# EAGLE design Adafruit PiCowbell Adalogger (EAGLE 9.6.2)
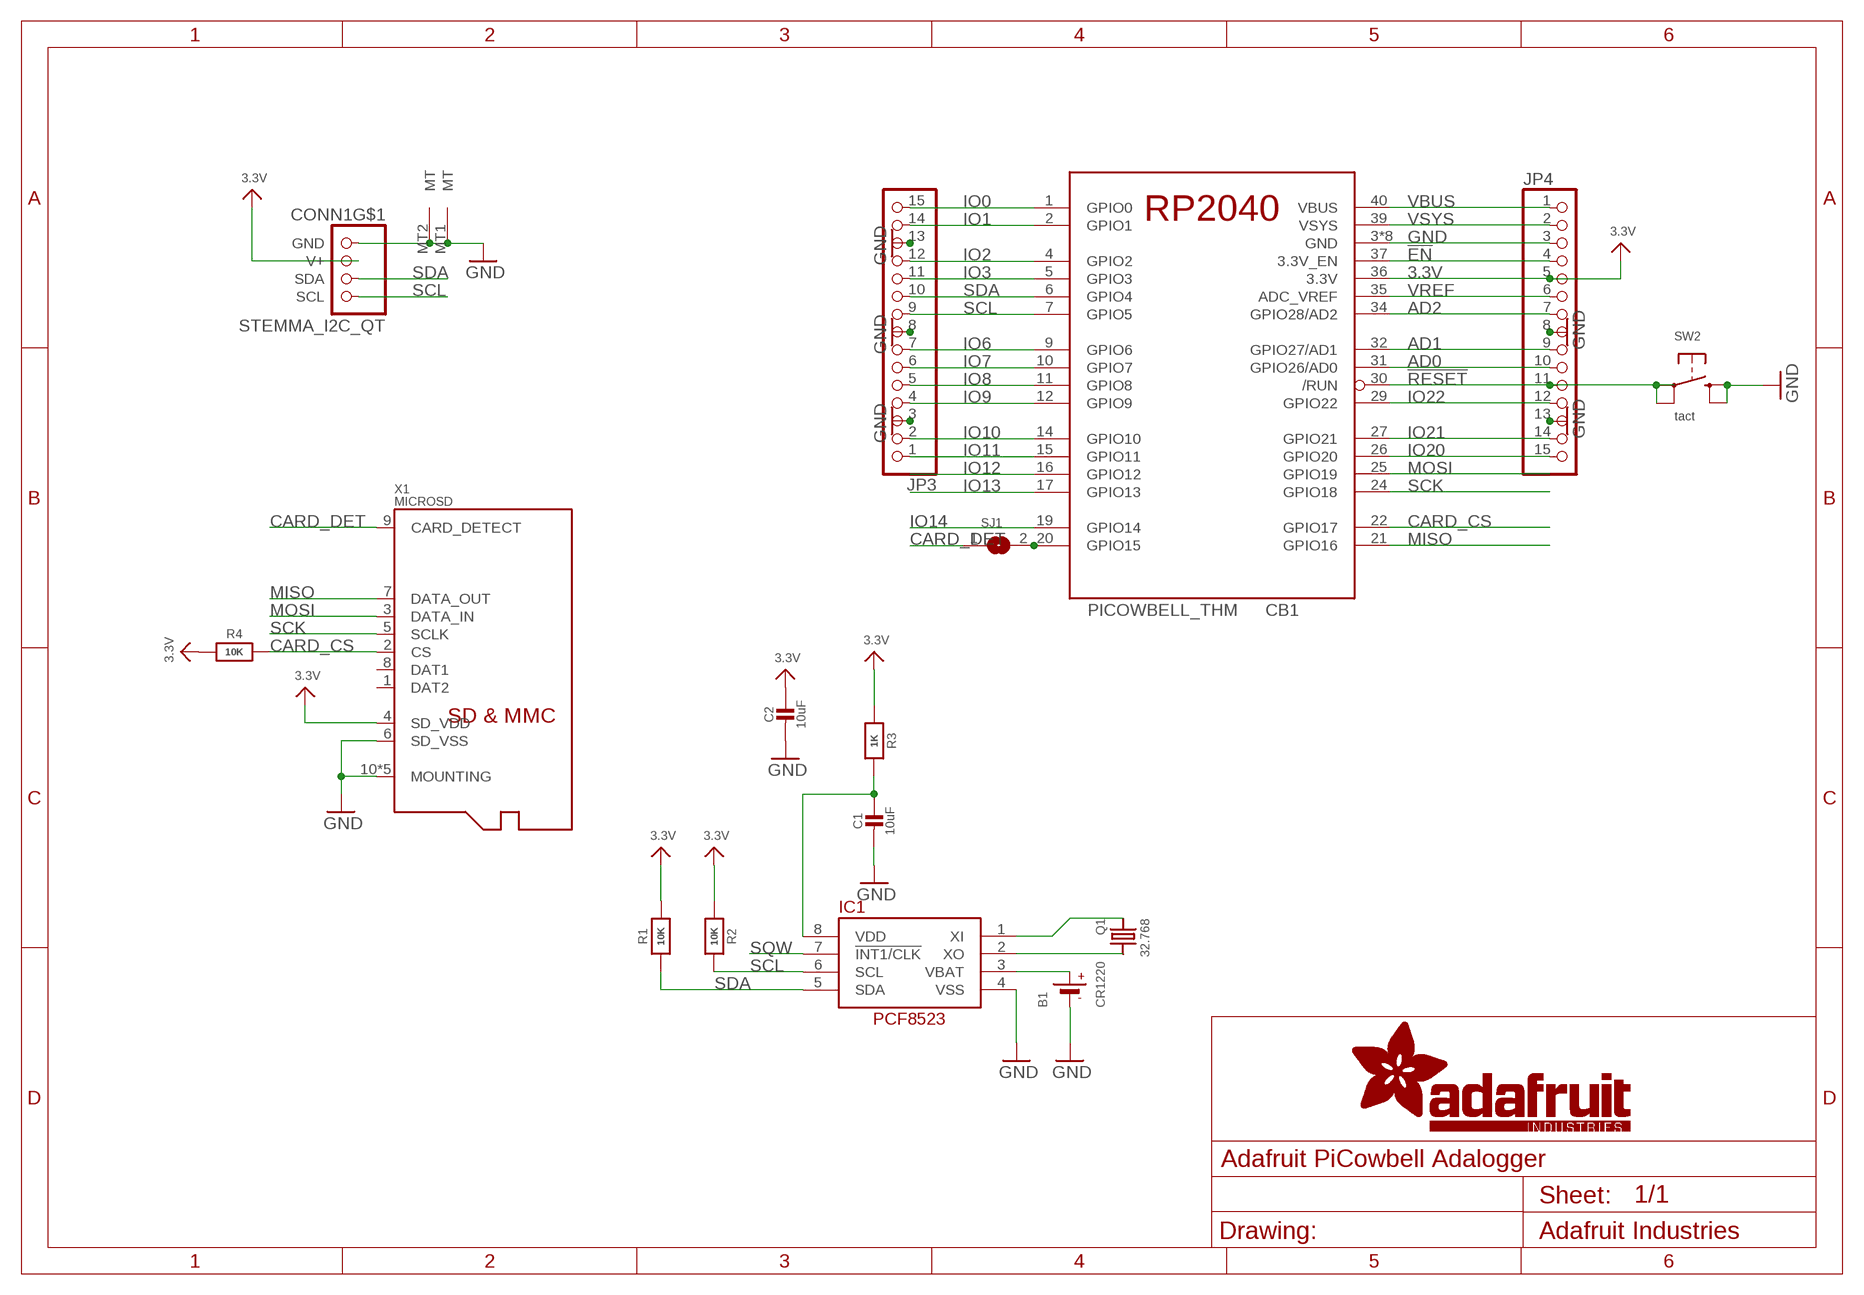
[diagram p0: schematic, sheet 1]

## Parts
B1  CR1220  BATTERYCR1220_2  [CR1220-2]
C1  10uF  CAP_CERAMIC0805-NOOUTLINE  [0805-NO]
C2  10uF  CAP_CERAMIC0805-NOOUTLINE  [0805-NO]
CB1  PICOWBELL_THM  [PICOWBELL_THM]
CONN1  STEMMA_I2C_QT  [JST_SH4]
IC1  RTC_PCF8523/T  [SOIC8_150MIL]
JP3  HEADER-1X15  [1X15_ROUND_70]
JP4  HEADER-1X15  [1X15_ROUND_70]
Q1  32.768  CRYSTAL_3215  [XTAL3215]
R1  10K  RESISTOR_0603_NOOUT  [0603-NO]
R2  10K  RESISTOR_0603_NOOUT  [0603-NO]
R3  1K  RESISTOR_0603_NOOUT  [0603-NO]
R4  10K  RESISTOR_0603_NOOUT  [0603-NO]
SJ1  SOLDERJUMPER  [SOLDERJUMPER_ARROW_NOPASTE]
SW2  tact  SWITCH_TACT_SMT_RKB2  [BTN_RKB2_4.6X2.8]
X1  MICROSD  MICROSD104031-0811  [MOLEX_104031-0811]

## Nets
3.3V: C2.1 CB1.36(3.3V) CONN1.2(V+) JP4.5 R1.2 R2.1 R3.1 R4.1 X1.4(SD_VDD)
!EN: CB1.37(3.3V_EN) JP4.4
!RESET: CB1.30(/RUN) JP4.11 SW2.A'(P1) SW2.A(P)
AD0: CB1.31(GPIO26/AD0) JP4.10
AD1: CB1.32(GPIO27/AD1) JP4.9
AD2: CB1.34(GPIO28/AD2) JP4.7
CARD_CS: CB1.22(GPIO17) R4.2 X1.2(CS)
CARD_DET: SJ1.1 X1.9(CARD_DETECT)
GND: B1.- C1.2 C2.2 CB1.3(GND) CB1.8(GND) CB1.13(GND) CB1.18(GND) CB1.23(GND) CB1.28(GND) CB1.33(GND) CB1.38(GND) CONN1.1(GND) CONN1.MT1(MT) CONN1.MT2(MT) IC1.4(VSS) JP3.3 JP3.8 JP3.13 JP4.3 JP4.8 JP4.13 SW2.B'(S1) SW2.B(S) X1.6(SD_VSS) X1.10(MOUNTING) X1.G1(MOUNTING) X1.G2(MOUNTING) X1.G3(MOUNTING) X1.G4(MOUNTING)
IO0: CB1.1(GPIO0) JP3.15
IO1: CB1.2(GPIO1) JP3.14
IO2: CB1.4(GPIO2) JP3.12
IO3: CB1.5(GPIO3) JP3.11
IO6: CB1.9(GPIO6) JP3.7
IO7: CB1.10(GPIO7) JP3.6
IO8: CB1.11(GPIO8) JP3.5
IO9: CB1.12(GPIO9) JP3.4
IO10: CB1.14(GPIO10) JP3.2
IO11: CB1.15(GPIO11) JP3.1
IO12: CB1.16(GPIO12)
IO13: CB1.17(GPIO13)
IO14: CB1.19(GPIO14)
IO20: CB1.26(GPIO20) JP4.15
IO21: CB1.27(GPIO21) JP4.14
IO22: CB1.29(GPIO22) JP4.12
MISO: CB1.21(GPIO16) X1.7(DATA_OUT)
MOSI: CB1.25(GPIO19) X1.3(DATA_IN)
N$1: CB1.20(GPIO15) SJ1.2
N$3: C1.1 IC1.8(VDD) R3.2
N$14: IC1.1(XI) Q1.P$1
N$15: IC1.2(XO) Q1.P$2
SCK: CB1.24(GPIO18) X1.5(SCLK)
SCL: CB1.7(GPIO5) CONN1.4(SCL) IC1.6(SCL) JP3.9 R2.2
SDA: CB1.6(GPIO4) CONN1.3(SDA) IC1.5(SDA) JP3.10 R1.1
SQW: IC1.7(!INT1/CLK)
VBAT: B1.+ IC1.3(VBAT)
VBUS: CB1.40(VBUS) JP4.1
VREF: CB1.35(ADC_VREF) JP4.6
VSYS: CB1.39(VSYS) JP4.2
Unconnected: X1.1(DAT2) X1.8(DAT1)

## Library data of the parts
B1 = adafruit_electromech:BATTERY: CR1220 SMT - Digikey: 3001K-ND CD2032 BAT-HLD-001 - Digikey: BAT-HLD-001-ND
C1 C2 = microbuilder:CAP_CERAMIC: Ceramic Capacitors For new designs, use the packages preceded by an '_' character since they are more reliable: The following footprints should be used on most boards: _0402 - Standard footprint for regular board layouts _0603 - Standard footprint for regular board layouts _0805 - Standard footprint for regular board layouts _1206 - Standard footprint for regular board layouts For extremely tight-pitch boards where space is at a premium, the following 'micro-pitch' footprints can be used (smaller pads, no silkscreen outline, etc.): _0402MP - Micro-pitch footprint for very dense/compact boards _0603MP - Micro-pitch footprint for very dense/compact boards _0805MP - Micro-pitch footprint for very dense/compact boards _1206MP - Micro-pitch footprint for very dense/compact boards
CB1 = adafruit_micro:PICOWBELL
CONN1 = adafruit_electromech:STEMMA_I2C; LCSC: C2845363
IC1 = microbuilder:RTC_PCF8523
JP3 JP4 = adafruit_electromech:HEADER-1X15: 1x15 Header
Q1 = microbuilder:CRYSTAL: Crystals HC49UP - Surface Mount Crystal 4.0MHz 18pF +/-30ppm Surface Mount Crystal [Digikey: 535-9857-1-ND] 12.0 MHz Surface Mount Crystal [Digikey: 535-9869-6-ND] 25.0 MHz Surface Mount Crystal [Digikey: 535-9078-1-ND] 2.5 x 2.0mm - MEMs SMT Crystal 16.0 MHz 10pF 20ppm 2.5 x 2.0mm Crystal [Digikey -40-85°C: 535-10923-1-ND] 3.2 x 2.5mm - MEMs SMT Crystal 12.0 MHz 8pF 15ppm 3.2 x 2.5mm Crystal [Digikey: -10-70°C: 644-1047-1-ND -40-125°C: 644-1128-1-ND] 40~85°C cheaper: 644-1173-6-ND 16.0 MHz 8pF 15ppm 3.2 x 2.5mm Crystal [Digikey: -10-70°C: 644-1049-1-ND -40-125°C: 644-1129-2-ND]-40~85°C cheaper: 644-1175-6-ND 16.0 MHz 10pF 10ppm 3.2 x 2.5mm Crystal [Digikey: 644-1100-1-ND] 27.12 MHz 18pF 30ppm 3.2 x 2.5mm Crystal [Digikey: 887-1424-1-ND] 27.12MHz 10pF 10ppm 3.2 x 2.5mm Crystal [Digikey: 887-1329-1-ND] 4.9 x 1.8mm - MEMs SMT Crystal 32.768 KHz 12.5pF 20ppm 4.9 x 1.8mm Crystal [Digikey: SE2415CT-ND] 8.0 x 3.8mm - Surface Mount Crystal 32.768kHz 12.5pF 20ppm -40°C-85°C [Digikey: 535-9166-2-ND] Cylinder 32.768KHz Cylinder Crystal (2x6mm body) [Ex. Digikey: 300-8341-2-ND]
R1-R4 = microbuilder:RESISTOR: Resistors For new designs, use the packages preceded by an '_' character since they are more reliable: The following footprints should be used on most boards: _0402 - Standard footprint for regular board layouts _0603 - Standard footprint for regular board layouts _0805 - Standard footprint for regular board layouts _1206 - Standard footprint for regular board layouts For extremely tight-pitch boards where space is at a premium, the following 'micro-pitch' footprints can be used (smaller pads, no silkscreen outline, etc.): _0402MP - Micro-pitch footprint for very dense/compact boards _0603MP - Micro-pitch footprint for very dense/compact boards _0805MP - Micro-pitch footprint for very dense/compact boards _1206MP - Micro-pitch footprint for very dense/compact boards
SJ1 = microbuilder:SOLDERJUMPER: SMD Solder JUMPER Solder the two pads together to create a connection, or remove the solder to break it. REFLOW - Use this footprint for solder paste and reflow ovens. WAVE - Use this footprint for hand-soldering (larger pads). CLOSED - Has a trace between the two pads to ensure it is closed by default. The trace needs to be cut to disable the jumper, and can be closed again by creating a solder bridge between the two pads.; BOM: EXCLUDE
SW2 = adafruit_electromech:SWITCH_TACT_SMT: SMT Tact Switches RKB2 https://www.digikey.com/short/m027prz5
X1 = adafruit_electromech:MICROSD: MicroSD/Transflash Card Holder with SPI pinout 3M: 2908-05WB-MG 4UConnector: 19656 Footprint courtesy: Adafruit Industries

## Board
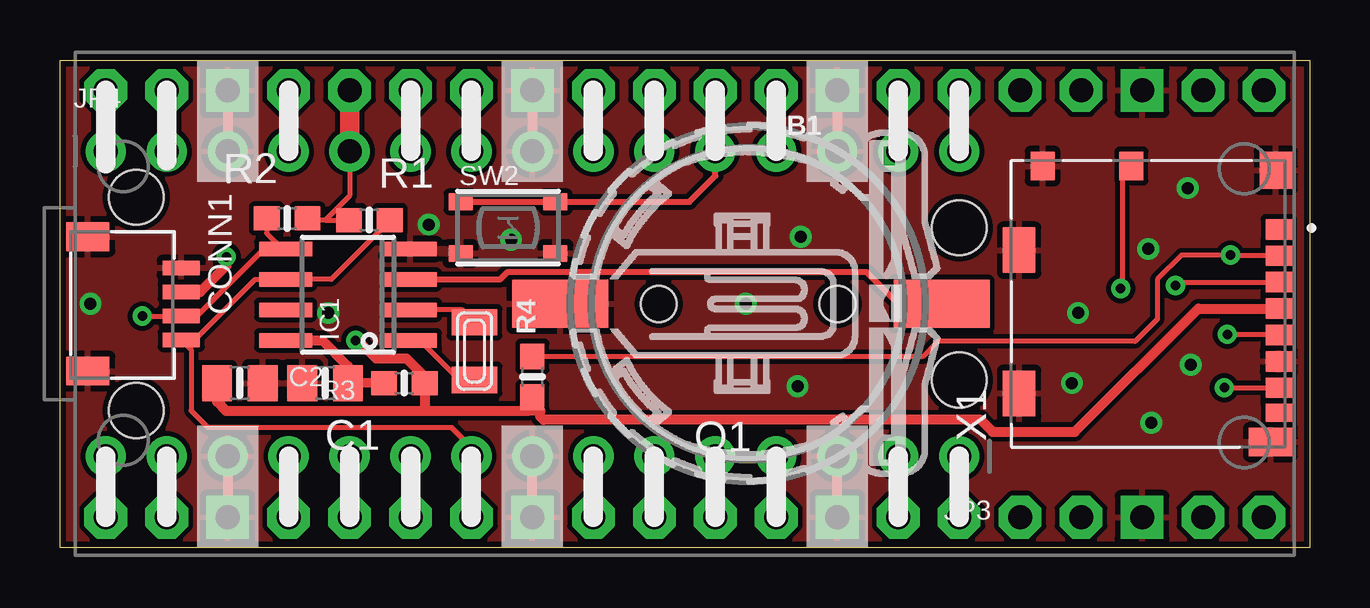
[diagram p1: board, top side]
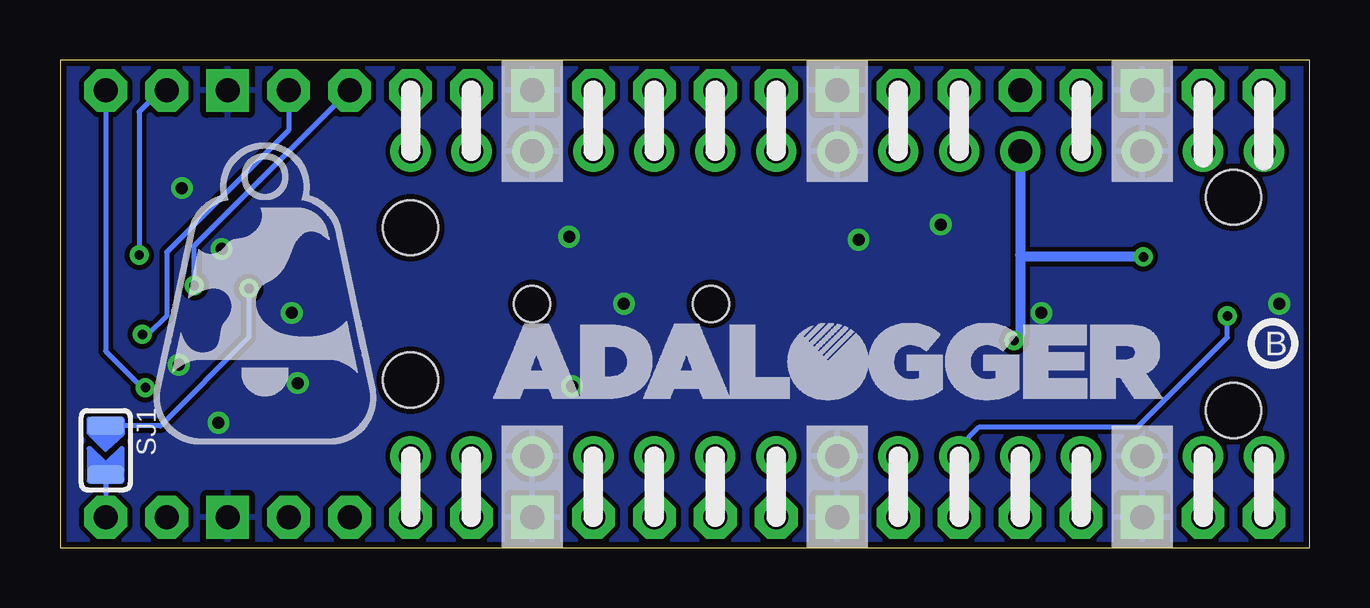
[diagram p2: board, bottom side, seen from below]

Size 52.07 x 20.32 mm. Coordinates in mm from the lower left corner, seen from the top.
Outline: 0,0 0,20.32 52.07,20.32 52.07,0 0,0
Copper layers (1*16): Top 0.035mm / dielectric 1.5mm / Bottom 0.035mm
Design rules "adafruit": minimum track width 8mil, minimum drill 15.5mil, track to track 8mil, track to pad 8mil, pad to pad 8mil, via to via 8mil, smd to smd 8mil, copper to edge 10mil, drill to drill 8mil, minimum pad ring 10mil, minimum via ring 8mil, stop-mask expansion 2mil, vias tented up to drill 20mil, thermal gap 10mil
Holes 2.29 mm at 3.17,14.61 3.17,5.71 37.47,13.33 37.47,6.98

### Footprints (pad centres in the part's own frame; a part is rotated, then mirrored left to right if it is on the bottom)
CR1220-2 = smd 4 x 2: + -8.29,0; - 7.6,0 | hole 1.5: -3.95,0; 3.5,0
0805-NO = smd 1.24 x 1.5: 1 -0.95,0; 2 0.95,0
PICOWBELL_THM = drill 1 pad 1.778 octagon: 1 1.27,0; 2 3.81,0; 4 8.89,0; 5 11.43,0; 6 13.97,0; 7 16.51,0; 9 21.59,0; 10 24.13,0; 11 26.67,0; 12 29.21,0; 14 34.29,0; 15 36.83,0; 16 39.37,0; 17 41.91,0; 19 46.99,0; 20 49.53,0; 21 49.53,17.78; 22 46.99,17.78; 24 41.91,17.78; 25 39.37,17.78; 26 36.83,17.78; 27 34.29,17.78; 29 29.21,17.78; 30 26.67,17.78; 31 24.13,17.78; 32 21.59,17.78; 34 16.51,17.78; 35 13.97,17.78; 36 11.43,17.78; 37 8.89,17.78; 39 3.81,17.78; 40 1.27,17.78 | drill 1 pad 1.778 square: 3 6.35,0; 8 19.05,0; 13 31.75,0; 18 44.45,0; 23 44.45,17.78; 28 31.75,17.78; 33 19.05,17.78; 38 6.35,17.78
JST_SH4 = smd 0.6 x 1.55: 1 -1.5,2.006; 2 -0.5,2.006; 3 0.5,2.006; 4 1.5,2.006 | smd 1.2 x 1.8: MT1 -2.8,-1.894; MT2 2.8,-1.894
SOIC8_150MIL = smd 0.6 x 2.2: 1 -1.905,-2.6; 2 -0.635,-2.6; 3 0.635,-2.6; 4 1.905,-2.6; 5 1.905,2.6; 6 0.635,2.6; 7 -0.635,2.6; 8 -1.905,2.6
1X15_ROUND_70 = drill 1 pad 1.676: 1 -17.78,0; 2 -15.24,0; 3 -12.7,0; 4 -10.16,0; 5 -7.62,0; 6 -5.08,0; 7 -2.54,0; 8 0,0; 9 2.54,0; 10 5.08,0; 11 7.62,0; 12 10.16,0; 13 12.7,0; 14 15.24,0; 15 17.78,0
XTAL3215 = smd 1.1 x 1.9: P$1 1.2,0; P$2 -1.2,0
0603-NO = smd 1.075 x 1: 1 -0.85,0; 2 0.85,0
SOLDERJUMPER_ARROW_NOPASTE = smd 0.762 x 1.524: 1 -1.016,0; 2 1.016,0
BTN_RKB2_4.6X2.8 = smd 1 x 0.7: A 1.973,1.075; A' -1.973,1.075; B 1.973,-1.075; B' -1.973,-1.075
MOLEX_104031-0811 = smd 0.85 x 1.1: 1 3.105,-5.45; 2 2.005,-5.45; 3 0.905,-5.45; 4 -0.195,-5.45; 5 -1.295,-5.45; 6 -2.395,-5.45; 7 -3.495,-5.45 | smd 0.75 x 1.1: 8 -4.545,-5.45 | smd 1.2 x 1: 9 5.74,0.7; 10 5.74,4.4 | smd 1.55 x 1.35: G1 5.565,-5.325 | smd 1.17 x 1.8: G2 -5.755,-5.1 | smd 1.9 x 1.35: G3 -3.73,5.375; G4 2.24,5.375

### Placement (x,y rotation side)
B1  28.45,10.16 180 top
C1  11.05,6.86 180 top
C2  7.49,6.86 0 top
CB1  0.64,1.27 0 top
CONN1  3.05,10.16 270 top
IC1  12,10.54 90 top
JP3  19.68,3.81 180 top
JP4  19.68,16.51 0 top
PLABEL0  [PLABEL0]  16,10.41 0 top
PLABEL1  [PLABEL1]  9.53,14.99 0 top
PLABEL2  [PLABEL2]  22.1,15.11 0 top
PLABEL3  [PLABEL3]  12.06,14.99 0 top
PLABEL4  [PLABEL4]  14.61,14.99 0 top
PLABEL5  [PLABEL5]  17.4,5.33 0 top
PLABEL6  [PLABEL6]  14.35,5.33 0 top
PLABEL7  [PLABEL7]  12.06,5.33 0 top
PLABEL8  [PLABEL8]  9.53,5.33 0 top
PLABEL9  [PLABEL9]  4.95,5.33 0 top
PLABEL10  [PLABEL10]  1.4,5.33 0 top
PLABEL11  [PLABEL11]  5.08,14.61 90 top
PLABEL12  [PLABEL12]  1.27,14.61 90 top
PLABEL13  [PLABEL13]  39.75,17.4 0 top
PLABEL14  [PLABEL14]  42.55,17.4 0 top
PLABEL15  [PLABEL15]  45.09,17.4 0 top
PLABEL16  [PLABEL16]  47.62,17.4 0 top
PLABEL17  [PLABEL17]  50.16,17.4 0 top
PLABEL18  [PLABEL18]  40.01,2.92 0 top
PLABEL19  [PLABEL19]  42.55,2.92 0 top
PLABEL20  [PLABEL20]  45.09,2.92 0 top
PLABEL21  [PLABEL21]  47.62,2.92 0 top
PLABEL22  [PLABEL22]  50.16,2.92 0 top
PLABEL23  [PLABEL23]  38.73,15.24 0 top
PLABEL24  [PLABEL24]  38.48,5.33 0 top
PLABEL25  [PLABEL25]  22.23,5.33 0 top
PLABEL26  [PLABEL26]  6.99,11.05 90 top
PLABEL27  [PLABEL27]  34.92,14.99 0 bottom
PLABEL30  [PLABEL30]  29.84,14.99 0 bottom
PLABEL31  [PLABEL31]  27.3,14.99 0 bottom
PLABEL32  [PLABEL32]  24.77,14.99 0 bottom
PLABEL33  [PLABEL33]  22.23,14.99 0 bottom
PLABEL34  [PLABEL34]  17.14,14.99 0 bottom
PLABEL35  [PLABEL35]  14.61,14.99 0 bottom
PLABEL36  [PLABEL36]  9.53,14.99 0 bottom
PLABEL37  [PLABEL37]  12.06,14.99 0 bottom
PLABEL38  [PLABEL38]  37.47,15.11 0 bottom
PLABEL39  [PLABEL39]  9.53,5.33 0 bottom
PLABEL40  [PLABEL40]  11.56,5.33 0 bottom
PLABEL41  [PLABEL41]  14.35,5.33 0 bottom
PLABEL42  [PLABEL42]  17.27,5.33 0 bottom
PLABEL43  [PLABEL43]  22.23,5.33 0 bottom
PLABEL44  [PLABEL44]  4.95,5.33 0 bottom
PLABEL45  [PLABEL45]  1.4,5.33 0 bottom
PLABEL46  [PLABEL46]  24.77,5.33 0 bottom
PLABEL47  [PLABEL47]  27.3,5.33 0 bottom
PLABEL48  [PLABEL48]  29.84,5.33 0 bottom
PLABEL49  [PLABEL49]  34.92,5.33 0 bottom
PLABEL50  [PLABEL50]  37.47,5.33 0 bottom
PLABEL51  [PLABEL51]  5.08,14.61 90 bottom
PLABEL52  [PLABEL52]  1.14,14.99 0 bottom
PLABEL53  [PLABEL53]  28.7,12.95 0 bottom
PLABEL54  [PLABEL54]  50.29,7.37 0 bottom
PLABEL55  [PLABEL55]  11.3,12.32 0 bottom
PLABEL56  [PLABEL56]  11.68,10.54 0 bottom
Q1  17.27,8.19 270 top
R1  9.46,13.72 0 top
R2  12.89,13.65 0 top
R3  14.35,6.86 180 top
R4  19.68,7.11 90 top
SJ1  50.16,4.06 270 bottom
SW2  18.67,13.33 0 top
U$10  [ADALOGGER_LOGO]  34.04,6.1 0 bottom
U$11  [COWBELL_0.5IN]  48.26,4.32 0 bottom
U$12  [PCBFEAT-REV-040]  1.52,8.51 0 bottom
X1  45.34,10.16 90 top

### Tracks (layer width: path | path; a pad name or v marks a point on that pad's centre or on a via)
3.3V  (via drill 0.39)
  Top 0.203: 11.05,13.65 10.38,13.65 R1.2 | 11.05,13.65 R2.1 | JP4.5 12.06,14.67 11.05,13.65
  Top 0.406: 15.2,5.7 R3.1 15.2,7.11 14.44,7.87 13.17,7.87 12.41,8.64 v12.32,8.64 | 15.2,5.7 6.91,5.7 6.54,6.07 C2.1 | CONN1.2 5.85,10.66 6.93,11.74 v6.93,12.12 | X1.4 47.43,9.96 42.29,4.83 38.86,4.83 38.37,5.32 20.14,5.32 20.01,5.45 20.01,5.7 19.51,5.7 | 15.2,5.7 19.51,5.7 | R4.1 19.68,5.88 19.51,5.7
  Top 0.813: CB1.36 JP4.5
  Bottom 0.406: JP4.5 12.06,12.19 | 12.06,12.19 12.06,8.89 v12.32,8.64 | v6.93,12.12 11.99,12.12 12.06,12.19
!EN
  Top 0.406: CB1.37 JP4.4
!RESET
  Top 0.254: SW2.A' SW2.A 26.22,14.41 27.3,15.49 JP4.11
  Top 0.406: CB1.30 JP4.11
AD0
  Top 0.406: CB1.31 JP4.10
AD1
  Top 0.406: CB1.32 JP4.9
AD2
  Top 0.406: CB1.34 JP4.7
CARD_CS  (via drill 0.39)
  Top 0.203: X1.2 50.76,12.19 v48.77,12.19 46.74,12.19 45.72,11.18 45.72,9.53 44.79,8.6 36.58,8.6 35.94,7.96 R4.2
  Bottom 0.203: CB1.22 47.88,19.05 48.77,18.16 v48.77,12.19
CARD_DET  (via drill 0.39)
  Top 0.203: X1.9 44.26,15.52 44.26,10.86 v44.2,10.79
  Bottom 0.203: v44.2,10.79 44.2,8.76 47.88,5.08 SJ1.1
GND  (via drill 0.5)
  Top 0.406: JP3.13 CB1.3 | CB1.8 JP3.8 | CB1.13 JP3.3 | CB1.28 JP4.13 | CB1.33 JP4.8 | CB1.38 JP4.3
  other vias: 1.27,10.16 11.18,9.78 15.37,13.46 18.8,12.83 28.57,10.16 30.73,6.73 30.86,12.95 42.42,9.78 42.16,6.86 45.47,5.21 47.12,7.62 46.99,14.99 45.34,12.45
  pour Top: 0,20.32 0,0 52.07,0 52.07,20.32
  pour Bottom: 0,20.32 0,0 52.07,0 52.07,20.32
IO0
  Top 0.406: JP3.15 CB1.1
IO1
  Top 0.406: CB1.2 JP3.14
IO2
  Top 0.406: CB1.4 JP3.12
IO3
  Top 0.406: JP3.11 CB1.5
IO6
  Top 0.406: CB1.9 JP3.7
IO7
  Top 0.406: CB1.10 JP3.6
IO8
  Top 0.406: CB1.11 JP3.5
IO9
  Top 0.406: CB1.12 JP3.4
IO10
  Top 0.406: CB1.14 JP3.2
IO11
  Top 0.406: CB1.15 JP3.1
IO20
  Top 0.406: CB1.26 JP4.15
IO21
  Top 0.406: CB1.27 JP4.14
IO22
  Top 0.406: CB1.29 JP4.12
MISO  (via drill 0.39)
  Top 0.203: v48.51,6.67 X1.7
  Bottom 0.203: CB1.21 50.16,8.19 48.64,6.67 v48.51,6.67
MOSI  (via drill 0.39)
  Top 0.203: v46.48,10.92 46.62,11.06 X1.3
  Bottom 0.203: v46.48,10.92 46.48,12.57 CB1.25
N$1
  Bottom 0.203: SJ1.2 CB1.20
N$3
  Top 0.406: IC1.8 10.93,8.64 12,7.56 C1.1 13.45,6.91 R3.2
N$14
  Top 0.203: IC1.1 14.99,8.64 16.64,6.99 Q1.P$1
N$15
  Top 0.203: Q1.P$2 16.76,9.91 IC1.2
SCK  (via drill 0.39)
  Top 0.203: v48.64,8.89 50.76,8.89 X1.5
  Bottom 0.203: CB1.24 42.55,17.4 47.62,12.32 47.62,9.65 48.39,8.89 v48.64,8.89
SCL
  Top 0.203: JP3.9 17.14,4.19 16.33,5 6.17,5 5.46,5.71 5.46,8.25 CONN1.4 5.61,8.66 8.13,11.18 IC1.6 11.3,11.18 13.74,13.61 R2.2
  Top 0.406: JP3.9 CB1.7
SDA  (via drill 0.39)
  Top 0.203: CONN1.3 5.08,9.66 | 5.08,9.66 5.72,9.66 8.51,12.45 9.27,12.45 | 9.27,12.45 IC1.5 | R1.1 8.61,13.11 9.27,12.45 | v3.43,9.65 5.07,9.65 5.08,9.66
  Top 0.406: CB1.6 JP3.10
  Bottom 0.203: JP3.10 14.61,4.19 13.77,5.03 7.16,5.03 3.43,8.76 v3.43,9.65
VBAT
  Top 0.254: IC1.3 18.33,11.18 18.65,11.49 33.59,11.49 35.05,10.03 36.67,10.03 B1.+
VBUS
  Top 0.813: CB1.40 JP4.1
VREF
  Top 0.406: CB1.35 JP4.6
VSYS
  Top 0.813: CB1.39 JP4.2

### Text on the board
Pinguin_tBackup: VB | VS | 3V | Vr | A2 | A0 | R | 22 | 20 | 19 | 18 | 17 | 16 | MO | SCK | G | CS | MI | I2C | G | EN | 3V | VR | A1 | 20 | VB | VS | 3 | I2C QT | RST | RESET | D | C | QT | 0 | 1 | 2 | 3 | SDA | SCL | 6 | 11 | 0 | 1 | 2 | 3 | 4 | 5 | 6 | 7 | 8 | 9 | 11 | 12 | 13 | 14 | 15 | 12 | 13 | G | 14 | 15
Pinguin_bBackup: VB | VS | 3V | Vr | A2 | A0 | R | 22 | 20 | 19 | 18 | 17 | 16 | VB | EN | 3V | VR | A2 | A1 | A0 | RST | 22 | 21 | 20 | VS | QT & PCF8523 on I2C 4+5 | SPI 16, 18, 19, CS:17 | SD / Det | 0 | 1 | 2 | 3 | SDA | SCL | 6 | 7 | 8 | 9 | 10 | 11 | 0 | 1 | 2 | 3 | 4 | 5 | 6 | 7 | 8 | 9 | 11 | 12 | 13 | 14 | 15